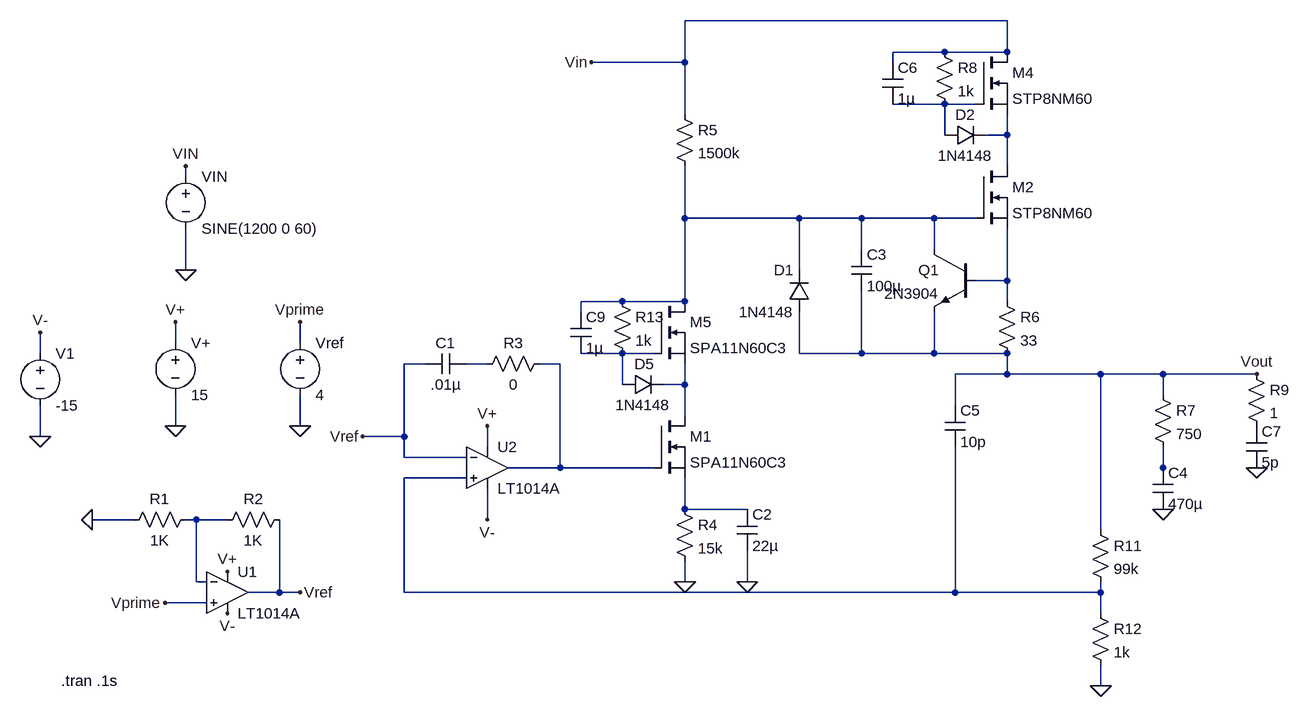
[diagram p0: schematic vregbrutep.asc]
vregbrutep.asc, the LTspice schematic file:
Version 4
SHEET 1 1328 1016
WIRE 816 -208 320 -208
WIRE 720 -160 640 -160
WIRE 816 -160 816 -208
WIRE 816 -160 720 -160
WIRE 320 -144 320 -208
WIRE 320 -144 176 -144
WIRE 640 -144 640 -160
WIRE 720 -80 640 -80
WIRE 768 -80 720 -80
WIRE 320 -64 320 -144
WIRE 720 -32 720 -80
WIRE 816 -32 816 -64
WIRE 816 -32 784 -32
WIRE 816 16 816 -32
WIRE -448 32 -448 16
WIRE 320 96 320 16
WIRE 496 96 320 96
WIRE 592 96 496 96
WIRE 704 96 592 96
WIRE 768 96 704 96
WIRE 592 144 592 96
WIRE 704 144 704 96
WIRE -448 176 -448 112
WIRE 496 176 496 96
WIRE 816 192 816 112
WIRE 816 192 768 192
WIRE 224 224 160 224
WIRE 320 224 320 96
WIRE 320 224 224 224
WIRE 816 224 816 192
WIRE 160 240 160 224
WIRE -464 288 -464 256
WIRE -272 288 -272 256
WIRE -672 304 -672 272
WIRE 224 304 160 304
WIRE 272 304 224 304
WIRE 496 304 496 240
WIRE 592 304 592 208
WIRE 592 304 496 304
WIRE 704 304 704 240
WIRE 704 304 592 304
WIRE 816 304 704 304
WIRE -80 320 -112 320
WIRE 16 320 -16 320
WIRE 128 320 96 320
WIRE 816 336 816 304
WIRE 816 336 736 336
WIRE 960 336 816 336
WIRE 1056 336 960 336
WIRE 1200 336 1056 336
WIRE 224 352 224 304
WIRE 320 352 320 320
WIRE 320 352 288 352
WIRE 1056 368 1056 336
WIRE 736 384 736 336
WIRE 320 400 320 352
WIRE -464 416 -464 368
WIRE -272 416 -272 368
WIRE -672 432 -672 384
WIRE -112 432 -112 320
WIRE -112 432 -176 432
WIRE 16 448 16 416
WIRE -112 464 -112 432
WIRE -16 464 -112 464
WIRE 128 480 128 320
WIRE 128 480 48 480
WIRE 272 480 128 480
WIRE 1056 480 1056 448
WIRE -16 496 -112 496
WIRE 1056 496 1056 480
WIRE 320 544 320 496
WIRE 416 544 320 544
WIRE -528 560 -592 560
WIRE -432 560 -448 560
WIRE -384 560 -432 560
WIRE 16 560 16 512
WIRE 960 576 960 336
WIRE -432 656 -432 560
WIRE -416 656 -432 656
WIRE 320 656 320 624
WIRE 416 656 416 608
WIRE -304 672 -304 560
WIRE -304 672 -352 672
WIRE -272 672 -304 672
WIRE -112 672 -112 496
WIRE 736 672 736 448
WIRE 736 672 -112 672
WIRE 960 672 960 656
WIRE 960 672 736 672
WIRE -416 688 -480 688
WIRE 960 704 960 672
WIRE 960 816 960 784
FLAG -464 416 0
FLAG -464 256 V+
FLAG -272 256 Vprime
FLAG -272 416 0
FLAG -448 176 0
FLAG -672 432 0
FLAG -672 272 V-
FLAG 960 816 0
FLAG 1056 544 0
FLAG 416 656 0
FLAG 320 656 0
FLAG 16 416 V+
FLAG -176 432 Vref
FLAG 176 -144 Vin
FLAG 1200 336 Vout
FLAG -448 16 VIN
FLAG -272 672 Vref
FLAG -480 688 Vprime
FLAG 16 560 V-
FLAG -384 640 V+
FLAG -384 704 V-
FLAG -592 560 0
FLAG 1200 480 0
SYMBOL voltage -448 16 R0
WINDOW 123 0 0 Left 2
WINDOW 39 0 0 Left 2
SYMATTR InstName VIN
SYMATTR Value SINE(1200 0 60)
SYMBOL voltage -464 272 R0
WINDOW 123 0 0 Left 2
WINDOW 39 0 0 Left 2
SYMATTR InstName V+
SYMATTR Value 15
SYMBOL voltage -272 272 R0
WINDOW 123 0 0 Left 2
WINDOW 39 0 0 Left 2
SYMATTR InstName Vref
SYMATTR Value 4
SYMBOL voltage -672 288 R0
WINDOW 123 0 0 Left 2
WINDOW 39 0 0 Left 2
SYMATTR InstName V1
SYMATTR Value -15
SYMBOL Opamps\\LT1014A 16 416 R0
SYMATTR InstName U2
SYMBOL cap -16 304 R90
WINDOW 0 0 32 VBottom 2
WINDOW 3 32 32 VTop 2
SYMATTR InstName C1
SYMATTR Value .01µ
SYMBOL res 112 304 R90
WINDOW 0 0 56 VBottom 2
WINDOW 3 32 56 VTop 2
SYMATTR InstName R3
SYMATTR Value 0
SYMBOL nmos 272 400 R0
SYMATTR InstName M1
SYMATTR Value SPA11N60C3
SYMBOL res 304 528 R0
SYMATTR InstName R4
SYMATTR Value 15k
SYMBOL cap 400 544 R0
SYMATTR InstName C2
SYMATTR Value 22µ
SYMBOL diode 512 240 R180
WINDOW 0 24 64 Left 2
WINDOW 3 24 0 Left 2
SYMATTR InstName D1
SYMATTR Value 1N4148
SYMBOL cap 576 144 R0
SYMATTR InstName C3
SYMATTR Value 100µ
SYMBOL npn 768 144 M0
SYMATTR InstName Q1
SYMATTR Value 2N3904
SYMBOL nmos 768 16 R0
SYMATTR InstName M2
SYMATTR Value STP8NM60
SYMBOL res 304 -80 R0
SYMATTR InstName R5
SYMATTR Value 1500k
SYMBOL res 800 208 R0
SYMATTR InstName R6
SYMATTR Value 33
SYMBOL res 1040 352 R0
SYMATTR InstName R7
SYMATTR Value 750
SYMBOL cap 1040 480 R0
SYMATTR InstName C4
SYMATTR Value 470µ
SYMBOL cap 720 384 R0
SYMATTR InstName C5
SYMATTR Value 10p
SYMBOL res 944 560 R0
SYMATTR InstName R11
SYMATTR Value 99k
SYMBOL res 944 688 R0
SYMATTR InstName R12
SYMATTR Value 1k
SYMBOL Opamps\\LT1014A -384 608 R0
SYMATTR InstName U1
SYMBOL res -432 544 R90
WINDOW 0 0 56 VBottom 2
WINDOW 3 32 56 VTop 2
SYMATTR InstName R1
SYMATTR Value 1K
SYMBOL res -288 544 R90
WINDOW 0 0 56 VBottom 2
WINDOW 3 32 56 VTop 2
SYMATTR InstName R2
SYMATTR Value 1K
SYMBOL nmos 768 -160 R0
SYMATTR InstName M4
SYMATTR Value STP8NM60
SYMBOL nmos 272 224 R0
SYMATTR InstName M5
SYMATTR Value SPA11N60C3
SYMBOL res 704 -176 R0
SYMATTR InstName R8
SYMATTR Value 1k
SYMBOL cap 624 -144 R0
SYMATTR InstName C6
SYMATTR Value 1µ
SYMBOL diode 720 -16 R270
WINDOW 0 32 32 VTop 2
WINDOW 3 0 32 VBottom 2
SYMATTR InstName D2
SYMATTR Value 1N4148
SYMBOL diode 224 368 R270
WINDOW 0 32 34 VTop 2
WINDOW 3 0 32 VBottom 2
SYMATTR InstName D5
SYMATTR Value 1N4148
SYMBOL res 208 208 R0
SYMATTR InstName R13
SYMATTR Value 1k
SYMBOL cap 144 240 R0
SYMATTR InstName C9
SYMATTR Value 1µ
SYMBOL res 1184 320 R0
SYMATTR InstName R9
SYMATTR Value 1
SYMBOL cap 1184 416 R0
SYMATTR InstName C7
SYMATTR Value 5p
TEXT -640 808 Left 2 !.tran .1s

The netlist it stands for:
* vregbrutep.asc
VIN Vin 0 SINE(1200 0 60)
V+ V+ 0 15
Vref Vprime 0 4
V1 V- 0 -15
XU2 N010 Vref V+ V- N007 LT1014A  ; pins In+ In- V+ V- OUT
C1 N006 Vref .01µ
R3 N007 N006 0
M1 N008 N007 N011 N011 SPA11N60C3
R4 N011 0 15k
C2 N011 0 22µ
D1 Vout N003 1N4148
C3 N003 Vout 100µ
Q1 N003 N004 Vout 0 2N3904
M2 N002 N003 N004 N004 STP8NM60
R5 Vin N003 1500k
R6 N004 Vout 33
R7 Vout N009 750
C4 N009 0 470µ
C5 Vout N010 10p
R11 Vout N010 99k
R12 N010 0 1k
XU1 Vprime N012 V+ V- Vref LT1014A  ; pins In+ In- V+ V- OUT
R1 N012 0 1K
R2 Vref N012 1K
M4 Vin N001 N002 N002 STP8NM60
M5 N003 N005 N008 N008 SPA11N60C3
R8 Vin N001 1k
C6 Vin N001 1µ
D2 N001 N002 1N4148
D5 N005 N008 1N4148
R13 N003 N005 1k
C9 N003 N005 1µ
R9 Vout P001 1
C7 P001 0 5p
.model D D
.lib standard.dio
.model NPN NPN
.model PNP PNP
.lib standard.bjt
.model NMOS NMOS
.model PMOS PMOS
.lib standard.mos
.tran .1s
.backanno
.end